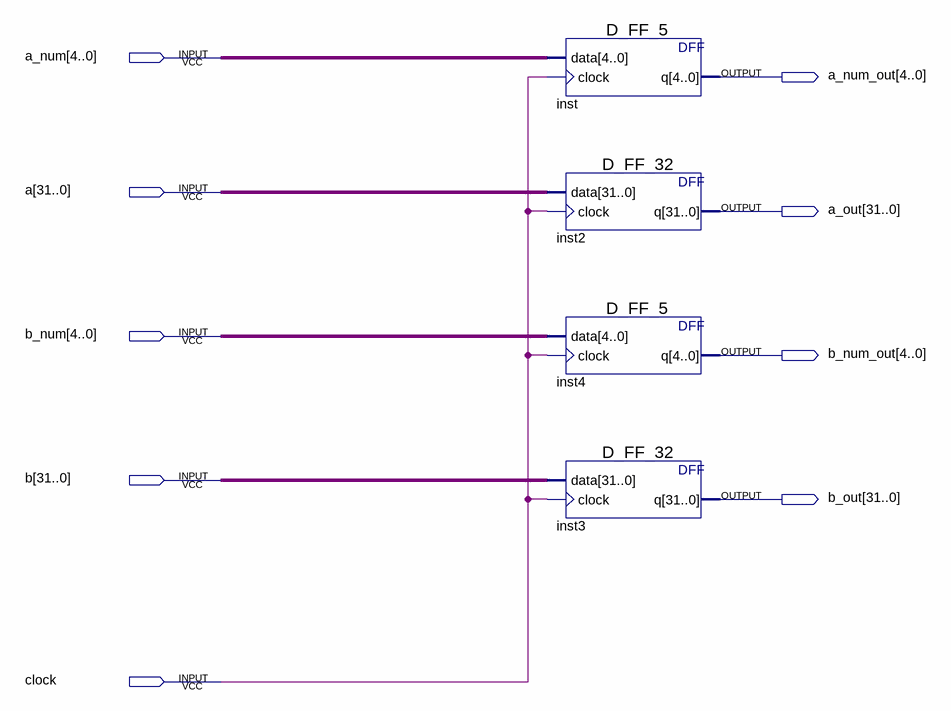
[diagram p0: schematic sheet]
// Quartus schematic Forward_reg.bdf as structural Verilog: 4 symbols, 9 pins
module Forward_reg (
  input  [4:0] a_num,
  input  [31:0] a,
  input  [4:0] b_num,
  input  [31:0] b,
  input  clock,
  output [4:0] a_num_out,
  output [31:0] a_out,
  output [4:0] b_num_out,
  output [31:0] b_out
);

  D_FF_5 inst (.data(a_num), .clock(clock), .q(a_num_out));
  D_FF_32 inst2 (.data(a), .clock(clock), .q(a_out));
  D_FF_5 inst4 (.data(b_num), .clock(clock), .q(b_num_out));
  D_FF_32 inst3 (.data(b), .clock(clock), .q(b_out));
endmodule
